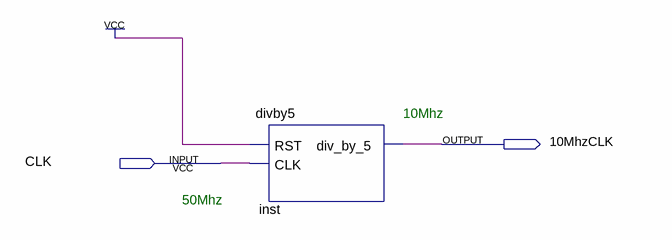
[diagram p0: schematic sheet]
// Quartus schematic 10mhz_clock.bdf as structural Verilog: 1 symbols, 2 pins
module \10mhz_clock  (
  input  CLK,
  output \10MhzCLK 
);

  divby5 inst (.RST(1'b1), .CLK(CLK), .div_by_5(\10MhzCLK ));

  // Notes on the sheet:
  //   10Mhz
  //   50Mhz
endmodule
